# EAGLE design pcb_17 (EAGLE 5.11)
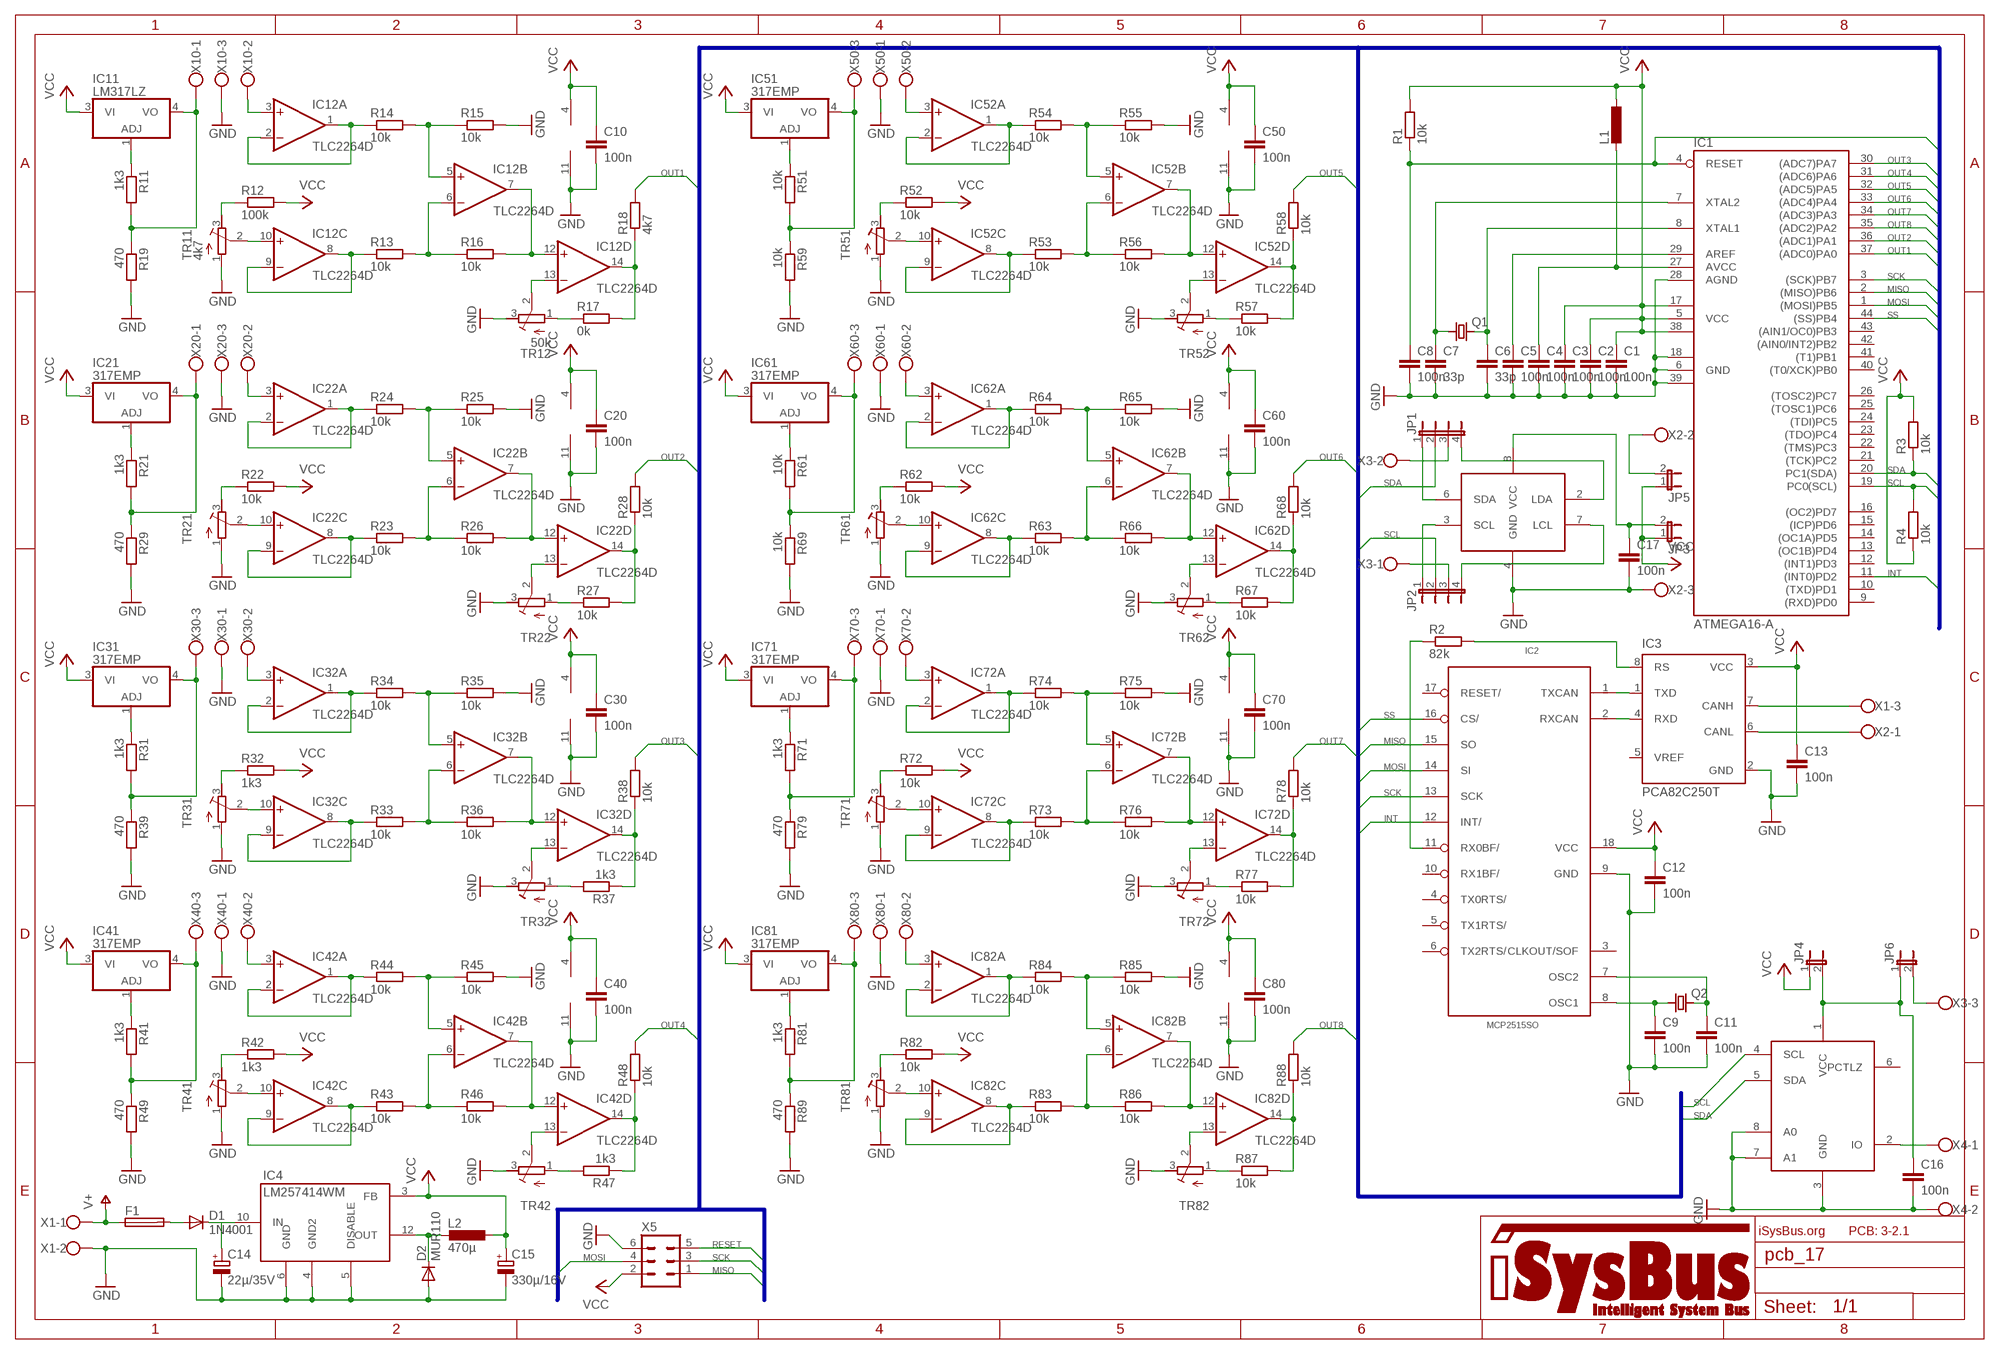
[diagram p0: schematic, sheet 1]

## Parts
C1  100n  CC0805K  [C0805K]
C2  100n  CC0805K  [C0805K]
C3  100n  CC0805K  [C0805K]
C4  100n  CC0805K  [C0805K]
C5  100n  CC0805K  [C0805K]
C6  33p  CC0805K  [C0805K]
C7  33p  CC0805K  [C0805K]
C8  100n  CC0805K  [C0805K]
C9  100n  CC0805K  [C0805K]
C10  100n  CC0805K  [C0805K]
C11  100n  CC0805K  [C0805K]
C12  100n  CC0805K  [C0805K]
C13  100n  CC0805K  [C0805K]
C14  22µ/35V  CPOL153CLV-0605  [153CLV-0605]
C15  330µ/16V  CPOL153CLV-0810  [153CLV-0810]
C16  100n  CC0805K  [C0805K]
C17  100n  CC0805K  [C0805K]
C20  100n  CC0805K  [C0805K]
C30  100n  CC0805K  [C0805K]
C40  100n  CC0805K  [C0805K]
C50  100n  CC0805K  [C0805K]
C60  100n  CC0805K  [C0805K]
C70  100n  CC0805K  [C0805K]
C80  100n  CC0805K  [C0805K]
D1  1N4001  [DO41-10]
D2  MUR110  [DO41-10]
F1  19560  [19560]
IC1  ATMEGA16-A  [TQFP44]
IC2  MCP2515SO  [SO18L]
IC3  PCA82C250T  [SO08]
IC4  LM257414WM  [14WM]
IC5  P82B715TD  [SO08]
IC6  DS2482-100SO  [SO08]
IC11  LM317LZ  317EMP  [SOT223]
IC12  TLC2264D  [SO14]
IC21  317EMP  [SOT223]
IC22  TLC2264D  [SO14]
IC31  317EMP  [SOT223]
IC32  TLC2264D  [SO14]
IC41  317EMP  [SOT223]
IC42  TLC2264D  [SO14]
IC51  317EMP  [SOT223]
IC52  TLC2264D  [SO14]
IC61  317EMP  [SOT223]
IC62  TLC2264D  [SO14]
IC71  317EMP  [SOT223]
IC72  TLC2264D  [SO14]
IC81  317EMP  [SOT223]
IC82  TLC2264D  [SO14]
JP1  JP4E  [JP4]
JP2  JP4E  [JP4]
JP3  JP1E  [JP1]
JP4  JP1E  [JP1]
JP5  JP1E  [JP1]
JP6  JP1E  [JP1]
L1  L-L0805  [L0805]
L2  470µ  L-0207/12  [0207/12]
Q1  Q  [HC49U-V]
Q2  Q  [HC49U-V]
R1  10k  R-EU_M0805  [M0805]
R2  82k  R-EU_M0805  [M0805]
R3  10k  R-EU_M0805  [M0805]
R4  10k  R-EU_M0805  [M0805]
R11  1k3  R-EU_M0805  [M0805]
R12  100k  R-EU_M0805  [M0805]
R13  10k  R-EU_M0805  [M0805]
R14  10k  R-EU_M0805  [M0805]
R15  10k  R-EU_M0805  [M0805]
R16  10k  R-EU_M0805  [M0805]
R17  0k  R-EU_M0805  [M0805]
R18  4k7  R-EU_M0805  [M0805]
R19  470  R-EU_M0805  [M0805]
R21  1k3  R-EU_M0805  [M0805]
R22  10k  R-EU_M0805  [M0805]
R23  10k  R-EU_M0805  [M0805]
R24  10k  R-EU_M0805  [M0805]
R25  10k  R-EU_M0805  [M0805]
R26  10k  R-EU_M0805  [M0805]
R27  10k  R-EU_M0805  [M0805]
R28  10k  R-EU_M0805  [M0805]
R29  470  R-EU_M0805  [M0805]
R31  1k3  R-EU_M0805  [M0805]
R32  1k3  R-EU_M0805  [M0805]
R33  10k  R-EU_M0805  [M0805]
R34  10k  R-EU_M0805  [M0805]
R35  10k  R-EU_M0805  [M0805]
R36  10k  R-EU_M0805  [M0805]
R37  1k3  R-EU_M0805  [M0805]
R38  10k  R-EU_M0805  [M0805]
R39  470  R-EU_M0805  [M0805]
R41  1k3  R-EU_M0805  [M0805]
R42  1k3  R-EU_M0805  [M0805]
R43  10k  R-EU_M0805  [M0805]
R44  10k  R-EU_M0805  [M0805]
R45  10k  R-EU_M0805  [M0805]
R46  10k  R-EU_M0805  [M0805]
R47  1k3  R-EU_M0805  [M0805]
R48  10k  R-EU_M0805  [M0805]
R49  470  R-EU_M0805  [M0805]
R51  10k  R-EU_M0805  [M0805]
R52  10k  R-EU_M0805  [M0805]
R53  10k  R-EU_M0805  [M0805]
R54  10k  R-EU_M0805  [M0805]
R55  10k  R-EU_M0805  [M0805]
R56  10k  R-EU_M0805  [M0805]
R57  10k  R-EU_M0805  [M0805]
R58  10k  R-EU_M0805  [M0805]
R59  10k  R-EU_M0805  [M0805]
R61  10k  R-EU_M0805  [M0805]
R62  10k  R-EU_M0805  [M0805]
R63  10k  R-EU_M0805  [M0805]
R64  10k  R-EU_M0805  [M0805]
R65  10k  R-EU_M0805  [M0805]
R66  10k  R-EU_M0805  [M0805]
R67  10k  R-EU_M0805  [M0805]
R68  10k  R-EU_M0805  [M0805]
R69  10k  R-EU_M0805  [M0805]
R71  1k3  R-EU_M0805  [M0805]
R72  10k  R-EU_M0805  [M0805]
R73  10k  R-EU_M0805  [M0805]
R74  10k  R-EU_M0805  [M0805]
R75  10k  R-EU_M0805  [M0805]
R76  10k  R-EU_M0805  [M0805]
R77  10k  R-EU_M0805  [M0805]
R78  10k  R-EU_M0805  [M0805]
R79  470  R-EU_M0805  [M0805]
R81  1k3  R-EU_M0805  [M0805]
R82  10k  R-EU_M0805  [M0805]
R83  10k  R-EU_M0805  [M0805]
R84  10k  R-EU_M0805  [M0805]
R85  10k  R-EU_M0805  [M0805]
R86  10k  R-EU_M0805  [M0805]
R87  10k  R-EU_M0805  [M0805]
R88  10k  R-EU_M0805  [M0805]
R89  470  R-EU_M0805  [M0805]
TR11  4k7  R-TRIMM64Y  [RTRIM64Y]
TR12  50k  R-TRIMM64Y  [RTRIM64Y]
TR21  R-TRIMM64Y  [RTRIM64Y]
TR22  R-TRIMM64Y  [RTRIM64Y]
TR31  R-TRIMM64Y  [RTRIM64Y]
TR32  R-TRIMM64Y  [RTRIM64Y]
TR41  R-TRIMM64Y  [RTRIM64Y]
TR42  R-TRIMM64Y  [RTRIM64Y]
TR51  R-TRIMM64Y  [RTRIM64Y]
TR52  R-TRIMM64Y  [RTRIM64Y]
TR61  R-TRIMM64Y  [RTRIM64Y]
TR62  R-TRIMM64Y  [RTRIM64Y]
TR71  R-TRIMM64Y  [RTRIM64Y]
TR72  R-TRIMM64Y  [RTRIM64Y]
TR81  R-TRIMM64Y  [RTRIM64Y]
TR82  R-TRIMM64Y  [RTRIM64Y]
U$1  ISYSBUS_LOGO  [ISYSBUS_LOGO]
U$2  FIELD_ISB_PLACE  [FIELD_ISB_PLACE]
U$4  3-2.1  FIELD_PCB_PLACE  [FIELD_PCB_PLACE]
X1  AKL-03_073-03  [AKL-03]
X2  AKL-03_073-03  [AKL-03]
X3  AKL-03_073-03  [AKL-03]
X4  AKL-02_073-02  [AKL-02]
X5  ML6  [ML6]
X10  AKL-03_073-03  [AKL-03]
X20  AKL-03_073-03  [AKL-03]
X30  AKL-03_073-03  [AKL-03]
X40  AKL-03_073-03  [AKL-03]
X50  AKL-03_073-03  [AKL-03]
X60  AKL-03_073-03  [AKL-03]
X70  AKL-03_073-03  [AKL-03]
X80  AKL-03_073-03  [AKL-03]

## Nets
GND: C1.2 C2.2 C3.2 C4.2 C5.2 C6.2 C7.2 C8.2 C9.2 C10.2 C11.2 C12.2 C13.2 C14.- C15.- C16.2 C17.2 C20.2 C30.2 C40.2 C50.2 C60.2 C70.2 C80.2 D2.A IC1.6(GND) IC1.18(GND1) IC1.28(AGND) IC1.39(GND2) IC2.9(GND) IC3.2(GND) IC4.4(GND2) IC4.5(DISABLE) IC4.6(GND) IC5.4(GND) IC6.3(GND) IC6.7(A1) IC6.8(A0) IC12.11(P:V-) IC22.11(P:V-) IC32.11(P:V-) IC42.11(P:V-) IC52.11(P:V-) IC62.11(P:V-) IC72.11(P:V-) IC82.11(P:V-) R15.2 R19.2 R25.2 R29.2 R35.2 R39.2 R45.2 R49.2 R55.2 R59.2 R65.2 R69.2 R75.2 R79.2 R85.2 R89.2 TR11.1(E) TR12.3(A) TR21.1(E) TR22.3(A) TR31.1(E) TR32.3(A) TR41.1(E) TR42.3(A) TR51.1(E) TR52.3(A) TR61.1(E) TR62.3(A) TR71.1(E) TR72.3(A) TR81.1(E) TR82.3(A) X1.2 X2.3 X4.2 X5.6 X10.3 X20.3 X30.1 X40.1 X50.1 X60.1 X70.1 X80.1
INT: IC1.11((INT0)PD2) IC2.12(INT/)
MISO: IC1.2((MISO)PB6) IC2.15(SO) X5.1
MOSI: IC1.1((MOSI)PB5) IC2.14(SI) X5.4
N$1: IC31.1(ADJ) R31.1
N$2: IC31.4(VO) R31.2 R39.1 X30.3
N$3: IC32.1(A:OUT) IC32.2(A:-IN) R34.1
N$4: IC32.8(C:OUT) IC32.9(C:-IN) R33.1
N$5: IC32.5(B:+IN) R34.2 R35.1
N$6: IC32.6(B:-IN) R33.2 R36.1
N$7: IC32.7(B:OUT) IC32.12(D:+IN) R36.2
N$8: IC32.10(C:+IN) TR31.2(S)
N$9: IC41.4(VO) R41.2 R49.1 X40.3
N$10: R32.1 TR31.3(A)
N$11: IC32.14(D:OUT) R37.1 R38.1
N$12: IC41.1(ADJ) R41.1
N$13: IC32.13(D:-IN) TR32.2(S)
N$14: R37.2 TR32.1(E)
N$15: IC32.3(A:+IN) X30.2
N$16: IC52.10(C:+IN) TR51.2(S)
N$17: IC42.3(A:+IN) X40.2
N$18: IC42.1(A:OUT) IC42.2(A:-IN) R44.1
N$19: IC42.8(C:OUT) IC42.9(C:-IN) R43.1
N$20: R42.1 TR41.3(A)
N$21: IC42.10(C:+IN) TR41.2(S)
N$22: IC42.6(B:-IN) R43.2 R46.1
N$23: IC42.7(B:OUT) IC42.12(D:+IN) R46.2
N$24: IC52.13(D:-IN) TR52.2(S)
N$25: IC42.5(B:+IN) R44.2 R45.1
N$26: R47.2 TR42.1(E)
N$27: IC42.14(D:OUT) R47.1 R48.1
N$28: IC42.13(D:-IN) TR42.2(S)
N$29: IC62.10(C:+IN) TR61.2(S)
N$30: IC62.13(D:-IN) TR62.2(S)
N$31: IC22.13(D:-IN) TR22.2(S)
N$32: IC22.10(C:+IN) TR21.2(S)
N$33: IC12.10(C:+IN) TR11.2(S)
N$34: IC12.13(D:-IN) TR12.2(S)
N$35: IC82.10(C:+IN) TR81.2(S)
N$36: IC82.13(D:-IN) TR82.2(S)
N$37: IC72.10(C:+IN) TR71.2(S)
N$38: IC72.13(D:-IN) TR72.2(S)
N$39: IC5.6(SDA) JP1.1
N$40: IC12.3(A:+IN) X10.2
N$41: IC72.3(A:+IN) X70.2
N$42: IC72.1(A:OUT) IC72.2(A:-IN) R74.1
N$43: IC72.8(C:OUT) IC72.9(C:-IN) R73.1
N$44: IC22.3(A:+IN) X20.2
N$45: IC82.3(A:+IN) X80.2
N$46: IC82.1(A:OUT) IC82.2(A:-IN) R84.1
N$47: IC82.8(C:OUT) IC82.9(C:-IN) R83.1
N$48: IC12.1(A:OUT) IC12.2(A:-IN) R14.1
N$49: IC12.8(C:OUT) IC12.9(C:-IN) R13.1
N$50: IC22.1(A:OUT) IC22.2(A:-IN) R24.1
N$51: IC22.8(C:OUT) IC22.9(C:-IN) R23.1
N$52: IC62.8(C:OUT) IC62.9(C:-IN) R63.1
N$53: IC62.1(A:OUT) IC62.2(A:-IN) R64.1
N$54: IC62.3(A:+IN) X60.2
N$55: R62.1 TR61.3(A)
N$56: IC51.4(VO) R51.2 R59.1 X50.3
N$57: IC52.3(A:+IN) X50.2
N$58: IC52.1(A:OUT) IC52.2(A:-IN) R54.1
N$59: IC52.8(C:OUT) IC52.9(C:-IN) R53.1
N$60: IC71.4(VO) R71.2 R79.1 X70.3
N$61: IC51.1(ADJ) R51.1
N$62: R52.1 TR51.3(A)
N$63: IC52.5(B:+IN) R54.2 R55.1
N$64: IC52.6(B:-IN) R53.2 R56.1
N$65: IC71.1(ADJ) R71.1
N$66: IC52.7(B:OUT) IC52.12(D:+IN) R56.2
N$67: IC81.1(ADJ) R81.1
N$68: R57.1 TR52.1(E)
N$69: IC52.14(D:OUT) R57.2 R58.1
N$70: IC11.1(ADJ) R11.1
N$71: IC21.1(ADJ) R21.1
N$72: IC81.4(VO) R81.2 R89.1 X80.3
N$73: IC11.4(VO) R11.2 R19.1 X10.1
N$74: IC21.4(VO) R21.2 R29.1 X20.1
N$75: IC82.6(B:-IN) R83.2 R86.1
N$76: IC82.7(B:OUT) IC82.12(D:+IN) R86.2
N$77: R87.1 TR82.1(E)
N$78: IC82.14(D:OUT) R87.2 R88.1
N$79: R82.1 TR81.3(A)
N$80: R72.1 TR71.3(A)
N$81: IC82.5(B:+IN) R84.2 R85.1
N$82: R77.1 TR72.1(E)
N$83: IC72.14(D:OUT) R77.2 R78.1
N$84: IC61.1(ADJ) R61.1
N$85: IC72.5(B:+IN) R74.2 R75.1
N$86: IC72.6(B:-IN) R73.2 R76.1
N$87: IC72.7(B:OUT) IC72.12(D:+IN) R76.2
N$88: IC61.4(VO) R61.2 R69.1 X60.3
N$89: IC62.6(B:-IN) R63.2 R66.1
N$90: IC62.7(B:OUT) IC62.12(D:+IN) R66.2
N$91: R67.1 TR62.1(E)
N$92: IC62.14(D:OUT) R67.2 R68.1
N$93: R12.1 TR11.3(A)
N$94: IC62.5(B:+IN) R64.2 R65.1
N$95: R22.1 TR21.3(A)
N$96: IC12.5(B:+IN) R14.2 R15.1
N$97: IC12.6(B:-IN) R13.2 R16.1
N$98: IC12.7(B:OUT) IC12.12(D:+IN) R16.2
N$99: IC22.5(B:+IN) R24.2 R25.1
N$100: IC22.6(B:-IN) R23.2 R26.1
N$101: IC22.7(B:OUT) IC22.12(D:+IN) R26.2
N$102: IC3.7(CANH) X1.3
N$103: R17.1 TR12.1(E)
N$104: IC12.14(D:OUT) R17.2 R18.1
N$105: C5.1 IC1.29(AREF)
N$106: IC22.14(D:OUT) R27.2 R28.1
N$107: C4.1 IC1.27(AVCC) L1.2
N$108: R27.1 TR22.1(E)
N$109: IC3.6(CANL) X2.1
N$110: D2.C IC4.12(OUT) L2.2
N$111: IC2.11(RX0BF/) R2.1
N$112: IC5.3(SCL) JP2.1
N$113: C6.1 IC1.8(XTAL1) Q1.2
N$114: C7.1 IC1.7(XTAL2) Q1.1
N$115: IC5.7(LCL) JP2.4
N$116: C14.+ D1.C IC4.10(IN)
N$117: IC6.2(IO) X4.1
N$118: D1.A F1.2
N$119: IC2.1(TXCAN) IC3.1(TXD)
N$120: IC2.2(RXCAN) IC3.4(RXD)
N$121: IC3.8(RS) R2.2
N$122: C9.1 IC2.8(OSC1) Q2.1
N$123: C11.1 IC2.7(OSC2) Q2.2
N$124: IC5.2(LDA) JP1.4
N$125: C17.1 IC5.8(VCC) JP3.2
N$126: JP1.3 X3.2
N$127: C16.1 IC6.1(VCC) JP4.2 JP6.1
N$128: JP5.2 X2.2
N$129: JP6.2 X3.3
OUT1: IC1.37((ADC0)PA0) R18.2
OUT2: IC1.36((ADC1)PA1) R28.2
OUT3: IC1.30((ADC7)PA7) R38.2
OUT4: IC1.31((ADC6)PA6) R48.2
OUT5: IC1.32((ADC5)PA5) R58.2
OUT6: IC1.33((ADC4)PA4) R68.2
OUT7: IC1.34((ADC3)PA3) R78.2
OUT8: IC1.35((ADC2)PA2) R88.2
RESET: C8.1 IC1.4(RESET) R1.1 X5.5
SCK: IC1.3((SCK)PB7) IC2.13(SCK) X5.3
SCL: IC1.19(PC0(SCL)) IC6.4(SCL) JP2.2 R4.2
SCL': JP2.3 X3.1
SDA: IC1.20(PC1(SDA)) IC6.5(SDA) JP1.2 R3.1
SS: IC1.44((SS)PB4) IC2.16(CS/)
V+: F1.1 X1.1
VCC: C1.1 C2.1 C3.1 C10.1 C12.1 C13.1 C15.+ C20.1 C30.1 C40.1 C50.1 C60.1 C70.1 C80.1 IC1.5(VCC) IC1.17(VCC1) IC1.38(VCC2) IC2.18(VCC) IC3.3(VCC) IC4.3(FB) IC11.3(VI) IC12.4(P:V+) IC21.3(VI) IC22.4(P:V+) IC31.3(VI) IC32.4(P:V+) IC41.3(VI) IC42.4(P:V+) IC51.3(VI) IC52.4(P:V+) IC61.3(VI) IC62.4(P:V+) IC71.3(VI) IC72.4(P:V+) IC81.3(VI) IC82.4(P:V+) JP3.1 JP4.1 JP5.1 L1.1 L2.1 R1.2 R3.2 R4.1 R12.2 R22.2 R32.2 R42.2 R52.2 R62.2 R72.2 R82.2 X5.2
Unconnected: IC1.9((RXD)PD0) IC1.10((TXD)PD1) IC1.12((INT1)PD3) IC1.13((OC1B)PD4) IC1.14((OC1A)PD5) IC1.15((ICP)PD6) IC1.16((OC2)PD7) IC1.21((TCK)PC2) IC1.22((TMS)PC3) IC1.23((TDO)PC4) IC1.24((TDI)PC5) IC1.25((TOSC1)PC6) IC1.26((TOSC2)PC7) IC1.40((T0/XCK)PB0) IC1.41((T1)PB1) IC1.42((AIN0/INT2)PB2) IC1.43((AIN1/OC0)PB3) IC2.3(CLKOUT/SOF) IC2.4(TX0RTS/) IC2.5(TX1RTS/) IC2.6(TX2RTS/) IC2.10(RX1BF/) IC2.17(RESET/) IC3.5(VREF) IC6.6(PCTLZ)

## Buses
RESET,SS,SCK,MISO,MOSI,INT,SCL,SDA,RXD,TXD,1W,OUT[1..8]

## Library data of the parts
C1-C13 C16 C17 C20 C30 C40 C50 C60 C70 C80 = isb_capacitors:C: CAPACITOR, European symbol
C14 C15 = isb_capacitors:CPOL: POLARIZED CAPACITOR, European symbol
D1 = isb_diodes:1N4001
D2 = isb_diodes:MUR110
F1 = isb_supply:19560: FUSE HOLDER TR5, Wickmann
IC1 = isb_microcontrollers:ATMEGA16
IC2 = isb_interfacecontrollers:MCP2515
IC3 = isb_interfacecontrollers:PCA82C250
IC4 = isb_supply:LM2574
IC5 = isb_interfacecontrollers:P82B715
IC6 = isb_interfacecontrollers:DS2482-100
IC11 IC21 IC31 IC41 IC51 IC61 IC71 IC81 = linear:*317: Positive VOLTAGE REGULATOR
IC12 IC22 IC32 IC42 IC52 IC62 IC72 IC82 = tcl2264:TLC2264: OP AMP
JP1 JP2 = jumper:JP4E: JUMPER
JP3-JP6 = jumper:JP1E: JUMPER
L1 L2 = isb_inductors:L: INDUCTOR, European symbol
Q1 Q2 = isb_oscillators:Q
R1-R4 R11-R19 R21-R29 R31-R39 R41-R49 R51-R59 R61-R69 R71-R79 R81-R89 = rcl:R-EU_: RESISTOR, European symbol
TR11 TR12 TR21 TR22 TR31 TR32 TR41 TR42 TR51 TR52 TR61 TR62 TR71 TR72 TR81 TR82 = rcl:R-TRIMM: Trimm resistor
U$1 = hausbus:ISYSBUS_LOGO
U$2 = isb_misc:FIELD_ISB
U$4 = isb_misc:FIELD_PCB
X1-X3 X10 X20 X30 X40 X50 X60 X70 X80 = isb_connectors:AKL-03_: WAGO SREW CLAMP
X4 = isb_connectors:AKL-02_: WAGO SREW CLAMP
X5 = isb_connectors:ML6: HARTING

## Board
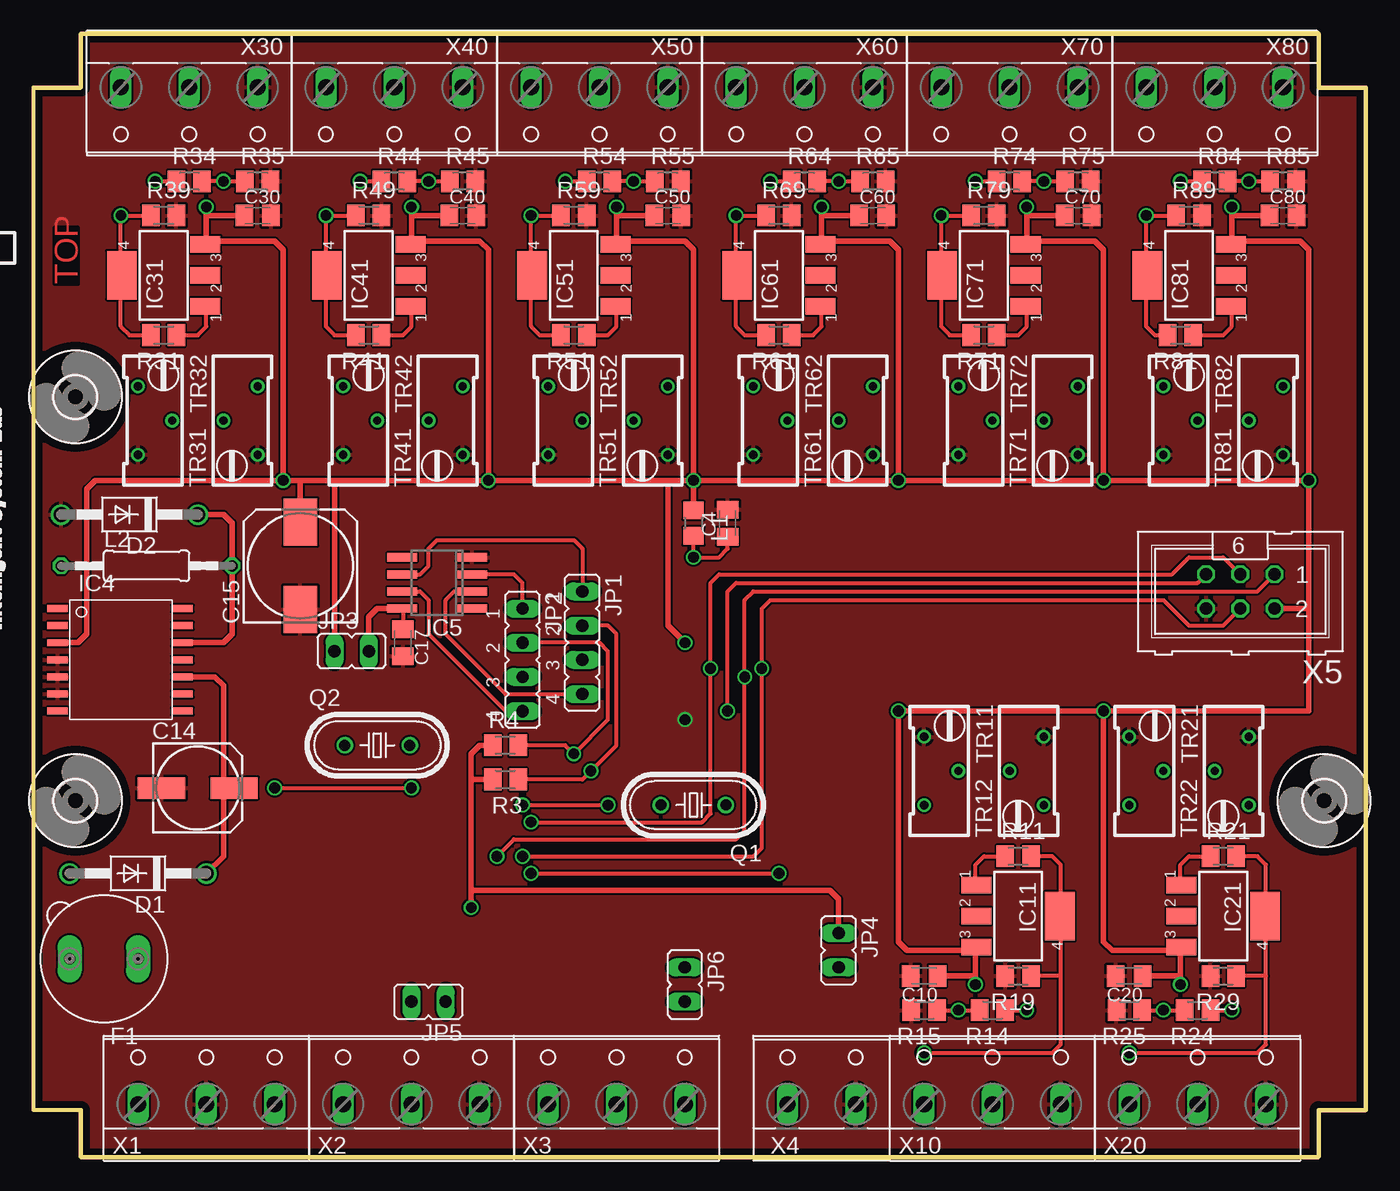
[diagram p1: board, top side]
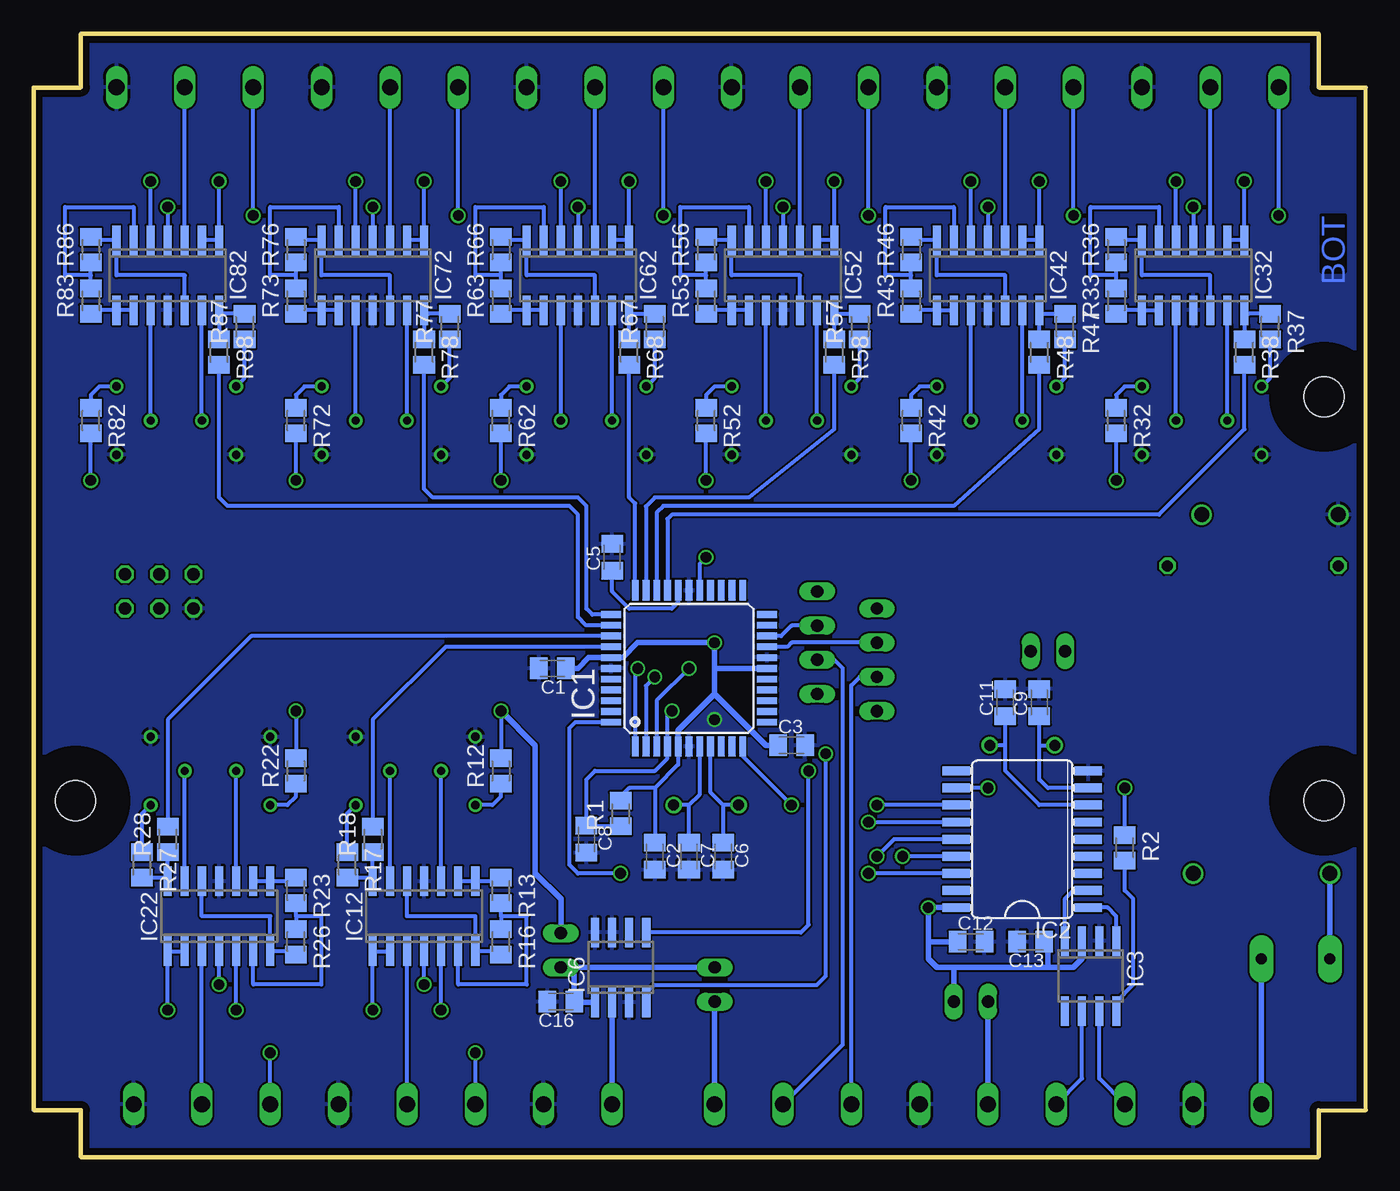
[diagram p2: board, bottom side, seen from below]

Size 99 x 83.5 mm. Coordinates in mm from the lower left corner, seen from the top.
Outline: 3.5,3.5 3.5,0 95.5,0 95.5,3.5 99,3.5 99,79.5 95.5,79.5 95.5,83.5 3.5,83.5 3.5,79.5 0,79.5 0,3.5 3.5,3.5
Copper layers (1*16): Top 0.035mm / dielectric 1.5mm / Bottom 0.035mm
Design rules "PCB-POOL": minimum track width 6mil, minimum drill 12mil, track to track 6mil, track to pad 6mil, pad to pad 6mil, via to via 6mil, smd to smd 6mil, copper to edge 20mil, drill to drill 8mil, minimum pad ring 8mil, minimum via ring 6mil, stop-mask expansion 3mil, vias tented up to drill 0mil, thermal gap 8mil
tKeepout: area 0,79.5 to 3.5,83.5; area 0,0 to 3.5,3.5
bKeepout: area 0,79.5 to 3.5,83.5; area 0,0 to 3.5,3.5
tRestrict: area 95.5,0 to 99,3.5
bRestrict: area 95.5,0 to 99,3.5
Milling: 12 lines

### Footprints (pad centres in the part's own frame; a part is rotated, then mirrored left to right if it is on the bottom)
C0805K = smd 1.3 x 1.6: 1 -1,0; 2 1,0
153CLV-0605 = smd 3.5 x 1.6: + 2.7,0; - -2.7,0
153CLV-0810 = smd 3.5 x 2.5: + 3.25,0; - -3.25,0
DO41-10 = drill 1.118 round: A 5.08,0; C -5.08,0
19560 = drill 0.813 pad 1.778 long: 1 -2.54,0; 2 2.54,0
TQFP44 = smd 1.5 x 0.5: 1 -5.8,4; 2 -5.8,3.2; 3 -5.8,2.4; 4 -5.8,1.6; 5 -5.8,0.8; 6 -5.8,0; 7 -5.8,-0.8; 8 -5.8,-1.6; 9 -5.8,-2.4; 10 -5.8,-3.2; 11 -5.8,-4; 23 5.8,-4; 24 5.8,-3.2; 25 5.8,-2.4; 26 5.8,-1.6; 27 5.8,-0.8; 28 5.8,0; 29 5.8,0.8; 30 5.8,1.6; 31 5.8,2.4; 32 5.8,3.2; 33 5.8,4 | smd 0.5 x 1.5: 12 -4,-5.8; 13 -3.2,-5.8; 14 -2.4,-5.8; 15 -1.6,-5.8; 16 -0.8,-5.8; 17 0,-5.8; 18 0.8,-5.8; 19 1.6,-5.8; 20 2.4,-5.8; 21 3.2,-5.8; 22 4,-5.8; 34 4,5.8; 35 3.2,5.8; 36 2.4,5.8; 37 1.6,5.8; 38 0.8,5.8; 39 0,5.8; 40 -0.8,5.8; 41 -1.6,5.8; 42 -2.4,5.8; 43 -3.2,5.8; 44 -4,5.8
SO18L = smd 0.66 x 2.032: 1 -5.08,-4.902; 2 -3.81,-4.902; 3 -2.54,-4.902; 4 -1.27,-4.902; 5 0,-4.902; 6 1.27,-4.902; 7 2.54,-4.902; 8 3.81,-4.902; 9 5.08,-4.902; 10 5.08,4.902; 11 3.81,4.902; 12 2.54,4.902; 13 1.27,4.902; 14 0,4.902; 15 -1.27,4.902; 16 -2.54,4.902; 17 -3.81,4.902; 18 -5.08,4.902
SO08 = smd 0.6 x 2.2: 1 -1.905,-2.6; 2 -0.635,-2.6; 3 0.635,-2.6; 4 1.905,-2.6; 5 1.905,2.6; 6 0.635,2.6; 7 -0.635,2.6; 8 -1.905,2.6
14WM = smd 0.508 x 1.524: 1 -3.175,-4.699; 2 -1.905,-4.699; 3 -0.635,-4.699; 4 0.635,-4.699; 5 1.905,-4.699; 6 3.175,-4.699; 7 4.445,-4.699; 8 4.445,4.572; 9 3.175,4.572; 10 1.905,4.572; 11 0.635,4.572; 12 -0.635,4.572; 13 -1.905,4.572; 14 -3.175,4.572
SOT223 = smd 1.219 x 2.235: 1 -2.311,-3.099; 2 0,-3.099; 3 2.311,-3.099 | smd 3.6 x 2.2: 4 0,3.099
SO14 = smd 0.6 x 2.2: 1 -3.81,-2.6; 2 -2.54,-2.6; 3 -1.27,-2.6; 4 0,-2.6; 5 1.27,-2.6; 6 2.54,-2.6; 7 3.81,-2.6; 8 3.81,2.6; 9 2.54,2.6; 10 1.27,2.6; 11 0,2.6; 12 -1.27,2.6; 13 -2.54,2.6; 14 -3.81,2.6
JP4 = drill 0.914 long: 1 -3.81,0; 2 -1.27,0; 3 1.27,0; 4 3.81,0
JP1 = drill 0.914 long: 1 0,-1.27; 2 0,1.27
L0805 = smd 1.3 x 1.5: 1 -0.95,0; 2 0.95,0
0207/12 = drill 0.813 octagon: 1 -6.35,0; 2 6.35,0
HC49U-V = drill 0.813 round: 1 -2.413,0; 2 2.413,0
M0805 = smd 1.3 x 1.6: 1 -0.95,0; 2 0.95,0
RTRIM64Y = drill 0.61 round: 1 0,-2.54; 2 -2.54,0; 3 0,2.54
3,0 = hole 3: 0,0
AKL-03 = drill 1.194 long: 1 -5.08,-0.635; 2 0,-0.635; 3 5.08,-0.635
AKL-02 = drill 1.194 long: 1 -2.54,-0.635; 2 2.54,-0.635
ML6 = drill 0.914 octagon: 1 -2.54,-1.27; 2 -2.54,1.27; 3 0,-1.27; 4 0,1.27; 5 2.54,-1.27; 6 2.54,1.27

### Placement (x,y rotation side)
C1  60.46,36.33 180 bottom
C2  52.84,22.36 270 bottom
C3  42.68,30.61 0 bottom
C4  51.57,47.12 90 top
C5  56.02,44.59 90 bottom
C6  47.76,22.36 270 bottom
C7  50.3,22.36 270 bottom
C8  57.92,23.63 270 bottom
C9  24.27,33.79 90 bottom
C10  66.17,13.47 180 top
C11  26.8,33.79 90 bottom
C12  29.34,16.01 0 bottom
C13  24.9,16.01 180 bottom
C14  12.2,27.44 0 top
C15  19.82,43.95 90 top
C16  59.83,11.56 180 bottom
C17  27.44,38.23 270 top
C20  81.42,13.47 180 top
C30  16.64,69.98 0 top
C40  31.88,69.98 0 top
C50  47.12,69.98 0 top
C60  62.37,69.98 0 top
C70  77.61,69.98 0 top
C80  92.84,69.98 0 top
D1  7.76,21.09 180 top
D2  7.12,47.76 180 top
F1  5.21,14.74 180 top
IC1  50.3,36.33 90 bottom
IC2  25.54,23.63 90 bottom
IC3  20.45,13.47 180 bottom
IC4  6.49,37.6 270 top
IC5  29.98,42.68 90 top
IC6  55.38,14.11 0 bottom
IC11  73.16,17.91 270 top
IC12  69.98,17.91 0 bottom
IC21  88.4,17.91 270 top
IC22  85.22,17.91 0 bottom
IC31  9.66,65.54 90 top
IC32  12.84,65.54 180 bottom
IC41  24.9,65.54 90 top
IC42  28.07,65.54 180 bottom
IC51  40.14,65.54 90 top
IC52  43.31,65.54 180 bottom
IC61  55.38,65.54 90 top
IC62  58.55,65.54 180 bottom
IC71  70.62,65.54 90 top
IC72  73.8,65.54 180 bottom
IC81  85.86,65.54 90 top
IC82  89.03,65.54 180 bottom
JP1  40.77,38.23 270 top
JP2  36.33,36.97 270 top
JP3  23.63,37.6 270 top
JP4  59.83,15.38 180 top
JP5  29.34,11.56 90 top
JP6  48.4,12.84 180 top
L1  49.03,47.12 270 top
L2  8.39,43.95 0 top
Q1  49.03,26.17 180 top
Q2  25.54,30.61 0 top
R1  55.38,25.54 90 bottom
R2  17.91,23 270 bottom
R3  35.06,28.07 180 top
R4  35.06,30.61 0 top
R11  73.16,22.36 0 top
R12  64.27,28.71 90 bottom
R13  64.27,19.82 270 bottom
R14  71.25,10.93 180 top
R15  66.17,10.93 180 top
R16  64.27,16.01 270 bottom
R17  75.7,21.73 270 bottom
R18  73.8,23.63 90 bottom
R19  73.16,13.47 180 top
R21  88.4,22.36 0 top
R22  79.51,28.71 90 bottom
R23  79.51,19.82 270 bottom
R24  86.5,10.93 180 top
R25  81.42,10.93 180 top
R26  79.51,16.01 270 bottom
R27  90.94,21.73 270 bottom
R28  89.03,23.63 90 bottom
R29  88.4,13.47 180 top
R31  9.66,61.09 180 top
R32  18.55,54.74 270 bottom
R33  18.55,63.64 90 bottom
R34  11.56,72.53 0 top
R35  16.64,72.53 0 top
R36  18.55,67.44 90 bottom
R37  7.12,61.73 270 bottom
R38  9.03,59.83 270 bottom
R39  9.66,69.98 0 top
R41  24.9,61.09 180 top
R42  33.79,54.74 270 bottom
R43  33.79,63.64 90 bottom
R44  26.8,72.53 0 top
R45  31.88,72.53 0 top
R46  33.79,67.44 90 bottom
R47  22.36,61.73 270 bottom
R48  24.27,59.83 270 bottom
R49  24.9,69.98 0 top
R51  40.14,61.09 180 top
R52  49.03,54.74 270 bottom
R53  49.03,63.64 90 bottom
R54  42.05,72.53 0 top
R55  47.12,72.53 0 top
R56  49.03,67.44 90 bottom
R57  37.6,61.73 90 bottom
R58  39.51,59.83 270 bottom
R59  40.14,69.98 0 top
R61  55.38,61.09 180 top
R62  64.27,54.74 270 bottom
R63  64.27,63.64 90 bottom
R64  57.28,72.53 0 top
R65  62.37,72.53 0 top
R66  64.27,67.44 90 bottom
R67  52.84,61.73 90 bottom
R68  54.74,59.83 270 bottom
R69  55.38,69.98 0 top
R71  70.62,61.09 180 top
R72  79.51,54.74 270 bottom
R73  79.51,63.64 90 bottom
R74  72.53,72.53 0 top
R75  77.61,72.53 0 top
R76  79.51,67.44 90 bottom
R77  68.08,61.73 90 bottom
R78  69.98,59.83 270 bottom
R79  70.62,69.98 0 top
R81  85.22,61.09 180 top
R82  94.75,54.74 270 bottom
R83  94.75,63.64 90 bottom
R84  87.77,72.53 0 top
R85  92.84,72.53 0 top
R86  94.75,67.44 90 bottom
R87  83.32,61.73 90 bottom
R88  85.22,59.83 270 bottom
R89  85.86,69.98 0 top
TR11  66.17,28.71 180 top
TR12  75.06,28.71 0 top
TR21  81.42,28.71 180 top
TR22  90.31,28.71 0 top
TR31  16.64,54.74 0 top
TR32  7.76,54.74 180 top
TR41  31.88,54.74 0 top
TR42  23,54.74 180 top
TR51  47.12,54.74 0 top
TR52  38.23,54.74 180 top
TR61  62.37,54.74 0 top
TR62  53.48,54.74 180 top
TR71  77.61,54.74 0 top
TR72  68.72,54.74 180 top
TR81  92.84,54.74 0 top
TR82  83.95,54.74 180 top
U$1  -2.09,28.39 90 top
U$2  -11.29,65.54 0 top  (outside the outline)
U$3  [3,0]  3.1,56.5 0 top
U$4  -10.66,61.09 0 top  (outside the outline)
U$5  [3,0]  3.1,26.5 0 top
U$7  [3,0]  95.9,26.5 0 top
X1  12.84,4.58 0 top
X2  28.07,4.58 0 top
X3  43.31,4.58 0 top
X4  58.55,4.58 0 top
X5  89.67,42.05 180 top
X10  71.25,4.58 0 top
X20  86.5,4.58 0 top
X30  11.56,78.88 180 top
X40  26.8,78.88 180 top
X50  42.05,78.88 180 top
X60  57.28,78.88 180 top
X70  72.53,78.88 180 top
X80  87.77,78.88 180 top

### Tracks (layer width: path | path; a pad name or v marks a point on that pad's centre or on a via)
GND  (via drill 0.8)
  other vias: 48.4,32.52
  pour Top: -0.5,-0.5 99.19,-0.5 99.19,83.95 -0.5,83.95
  pour Bottom: -0.5,-0.5 99.19,-0.5 99.19,83.95 -0.5,83.95
INT  (via drill 0.8)
  Top 0.305: v36.33,26.17 v42.68,26.17
  Bottom 0.305: IC2.12 v36.33,26.17 | IC1.11 46.3,29.79 v42.68,26.17
MISO  (via drill 0.8)
  Top 0.305: X5.1 90.94,42.05 53.48,42.05 52.84,41.41 v52.84,35.7 52.84,24.27 52.2,23.63 35.7,23.63 v34.42,22.36
  Bottom 0.305: IC2.15 v34.42,22.36 | IC1.2 53.5,35.03 v52.84,35.7
MOSI  (via drill 0.8)
  Top 0.305: X5.4 88.4,39.51 85.86,39.51 83.95,41.41 54.74,41.41 54.11,40.77 v54.11,36.33 54.11,23 53.48,22.36 v36.33,22.36
  Bottom 0.305: IC1.1 54.3,36.14 v54.11,36.33 | IC2.14 35.06,23.63 v36.33,22.36
N$1
  Top 0.305: R31.1 12.2,61.09 12.84,61.73 12.84,63.15 IC31.1
N$2  (via drill 0.8)
  Top 0.305: R31.2 7.12,61.09 6.49,61.73 6.49,65.46 IC31.4 6.49,65.62 v6.49,69.98 R39.1
  Bottom 0.305: v6.49,69.98 X30.3
N$3  (via drill 0.8)
  Top 0.305: v9.03,72.53 R34.1
  Bottom 0.305: v9.03,72.53 IC32.1 IC32.2
N$4
  Bottom 0.305: IC32.9 IC32.8 18.3,62.94 R33.1
N$5  (via drill 0.8)
  Top 0.305: R34.2 v14.11,72.53 R35.1
  Bottom 0.305: IC32.5 v14.11,72.53
N$6
  Bottom 0.305: IC32.6 15.38,70.62 20.45,70.62 20.45,65.54 18.55,65.54 | 18.55,65.54 R36.1 | R33.2 18.55,65.54
N$7
  Bottom 0.305: IC32.12 11.56,65.54 16.64,65.54 IC32.7 18.3,68.14 R36.2
N$8
  Bottom 0.305: TR31.2 IC32.10
N$9  (via drill 0.8)
  Top 0.305: R49.1 v21.73,69.98 21.73,65.62 IC41.4 21.73,65.46 21.73,61.73 22.36,61.09 R41.2
  Bottom 0.305: v21.73,69.98 X40.3
N$10
  Bottom 0.305: R32.1 18.55,56.65 17.91,57.28 TR31.3
N$11
  Bottom 0.305: 9.03,62.37 R38.1 | 9.03,62.37 IC32.14 | R37.1 8.71,62.68 9.03,62.37
N$12
  Top 0.305: R41.1 27.44,61.09 28.07,61.73 28.07,63.15 IC41.1
N$13
  Bottom 0.305: TR32.2 IC32.13
N$14
  Bottom 0.305: R37.2 7.12,57.92 TR32.1
N$15
  Bottom 0.305: IC32.3 X30.2
N$16
  Bottom 0.305: TR51.2 IC52.10
N$17
  Bottom 0.305: IC42.3 X40.2
N$18  (via drill 0.8)
  Top 0.305: v24.27,72.53 R44.1
  Bottom 0.305: v24.27,72.53 IC42.1 IC42.2
N$19
  Bottom 0.305: R43.1 33.53,62.94 IC42.8 IC42.9
N$20
  Bottom 0.305: R42.1 33.79,56.65 33.16,57.28 TR41.3
N$21
  Bottom 0.305: TR41.2 IC42.10
N$22
  Bottom 0.305: IC42.6 30.61,70.62 35.7,70.62 35.7,65.54 33.79,65.54 | 33.79,65.54 R46.1 | R43.2 33.79,65.54
N$23
  Bottom 0.305: IC42.12 26.8,65.54 31.88,65.54 IC42.7 33.53,68.14 R46.2
N$24
  Bottom 0.305: TR52.2 IC52.13
N$25  (via drill 0.8)
  Top 0.305: R44.2 v29.34,72.53 R45.1
  Bottom 0.305: IC42.5 v29.34,72.53
N$26
  Bottom 0.305: R47.2 22.36,57.92 TR42.1
N$27
  Bottom 0.305: R48.1 24.27,62.37 | 24.27,62.37 IC42.14 | R47.1 23.95,62.68 24.27,62.37
N$28
  Bottom 0.305: TR42.2 IC42.13
N$29
  Bottom 0.305: TR61.2 IC62.10
N$30
  Bottom 0.305: TR62.2 IC62.13
N$31
  Bottom 0.305: IC22.13 TR22.2
N$32
  Bottom 0.305: IC22.10 TR21.2
N$33
  Bottom 0.305: IC12.10 TR11.2
N$34
  Bottom 0.305: IC12.13 TR12.2
N$35
  Bottom 0.305: TR81.2 IC82.10
N$36
  Bottom 0.305: TR82.2 IC82.13
N$37
  Bottom 0.305: TR71.2 IC72.10
N$38
  Bottom 0.305: TR72.2 IC72.13
N$39
  Top 0.305: IC5.6 28.71,43.31 29.34,43.95 29.34,45.22 29.98,45.85 40.14,45.85 40.77,45.22 JP1.1
N$40
  Bottom 0.305: X10.2 IC12.3
N$41
  Bottom 0.305: IC72.3 X70.2
N$42  (via drill 0.8)
  Top 0.305: v69.98,72.53 R74.1
  Bottom 0.305: v69.98,72.53 IC72.1 IC72.2
N$43
  Bottom 0.305: IC72.8 IC72.9 79.25,62.94 R73.1
N$44
  Bottom 0.305: X20.2 IC22.3
N$45
  Bottom 0.305: IC82.3 X80.2
N$46  (via drill 0.8)
  Top 0.305: v85.22,72.53 R84.1
  Bottom 0.305: v85.22,72.53 IC82.1 IC82.2
N$47
  Bottom 0.305: IC82.9 IC82.8 94.75,62.94 R83.1
N$48  (via drill 0.8)
  Top 0.305: R14.1 v73.8,10.93
  Bottom 0.305: v73.8,10.93 IC12.1 IC12.2
N$49
  Bottom 0.305: IC12.9 IC12.8 64.53,20.52 R13.1
N$50  (via drill 0.8)
  Top 0.305: R24.1 v89.03,10.93
  Bottom 0.305: v89.03,10.93 IC22.1 IC22.2
N$51
  Bottom 0.305: IC22.9 IC22.8 79.77,20.52 R23.1
N$52
  Bottom 0.305: IC62.9 IC62.8 64.02,62.94 R63.1
N$53  (via drill 0.8)
  Top 0.305: v54.74,72.53 R64.1
  Bottom 0.305: v54.74,72.53 IC62.1 IC62.2
N$54
  Bottom 0.305: IC62.3 X60.2
N$55
  Bottom 0.305: R62.1 64.27,56.65 63.64,57.28 TR61.3
N$56  (via drill 0.8)
  Top 0.305: R51.2 37.6,61.09 36.97,61.73 36.97,65.46 IC51.4 36.97,65.62 v36.97,69.98 R59.1
  Bottom 0.305: v36.97,69.98 X50.3
N$57
  Bottom 0.305: IC52.3 X50.2
N$58  (via drill 0.8)
  Top 0.305: v39.51,72.53 R54.1
  Bottom 0.305: v39.51,72.53 IC52.1 IC52.2
N$59
  Bottom 0.305: IC52.9 IC52.8 49.03,62.94 R53.1
N$60  (via drill 0.8)
  Top 0.305: R79.1 v67.44,69.98 67.44,65.62 IC71.4 67.44,65.46 67.44,61.73 68.08,61.09 R71.2
  Bottom 0.305: v67.44,69.98 X70.3
N$61
  Top 0.305: R51.1 42.68,61.09 43.31,61.73 43.31,63.15 IC51.1
N$62
  Bottom 0.305: R52.1 49.03,56.65 48.4,57.28 TR51.3
N$63  (via drill 0.8)
  Top 0.305: R54.2 v44.59,72.53 R55.1
  Bottom 0.305: IC52.5 v44.59,72.53
N$64
  Bottom 0.305: R53.2 49.03,65.54 | 49.03,65.54 R56.1 | IC52.6 45.85,70.62 50.94,70.62 50.94,65.54 49.03,65.54
N$65
  Top 0.305: R71.1 73.16,61.09 73.8,61.73 73.8,63.15 IC71.1
N$66
  Bottom 0.305: IC52.12 42.05,65.54 47.12,65.54 IC52.7 49.03,68.14 R56.2
N$67
  Top 0.305: R81.1 88.4,61.09 89.03,61.73 89.03,63.15 IC81.1
N$68
  Bottom 0.305: R57.1 37.6,57.92 TR52.1
N$69
  Bottom 0.305: R58.1 39.51,62.37 | 39.51,62.37 IC52.14 | R57.2 39.19,62.68 39.51,62.37
N$70
  Top 0.305: R11.1 70.62,22.36 69.98,21.73 69.98,20.3 IC11.1
N$71
  Top 0.305: R21.1 85.86,22.36 85.22,21.73 85.22,20.3 IC21.1
N$72  (via drill 0.8)
  Top 0.305: R81.2 83.32,61.09 82.69,61.73 82.69,65.46 IC81.4 82.69,65.62 v82.69,69.98 R89.1
  Bottom 0.305: v82.69,69.98 X80.3
N$73  (via drill 0.8)
  Top 0.305: 76.33,13.47 R19.1 | 76.33,13.47 76.33,17.84 IC11.4 76.33,17.99 76.33,21.73 75.7,22.36 R11.2 | v66.17,7.76 75.7,7.76 76.33,8.39 76.33,13.47
  Bottom 0.305: X10.1 v66.17,7.76
N$74  (via drill 0.8)
  Top 0.305: R21.2 90.94,22.36 91.58,21.73 91.58,17.99 IC21.4 91.58,17.84 91.58,13.47 | 91.58,13.47 R29.1 | v81.42,7.76 90.94,7.76 91.58,8.39 91.58,13.47
  Bottom 0.305: X20.1 v81.42,7.76
N$75
  Bottom 0.305: IC82.6 91.58,70.62 96.66,70.62 96.66,65.54 94.75,65.54 | 94.75,65.54 R86.1 | R83.2 94.75,65.54
N$76
  Bottom 0.305: IC82.12 87.77,65.54 92.84,65.54 IC82.7 94.75,68.14 R86.2
N$77
  Bottom 0.305: R87.1 83.32,57.92 TR82.1
N$78
  Bottom 0.305: 85.22,62.37 R88.1 | 85.22,62.37 IC82.14 | R87.2 84.91,62.68 85.22,62.37
N$79
  Bottom 0.305: R82.1 94.75,56.65 94.11,57.28 TR81.3
N$80
  Bottom 0.305: R72.1 79.51,56.65 78.88,57.28 TR71.3
N$81  (via drill 0.8)
  Top 0.305: R84.2 v90.31,72.53 R85.1
  Bottom 0.305: IC82.5 v90.31,72.53
N$82
  Bottom 0.305: R77.1 68.08,57.92 TR72.1
N$83
  Bottom 0.305: 69.98,62.37 R78.1 | 69.98,62.37 IC72.14 | R77.2 69.67,62.68 69.98,62.37
N$84
  Top 0.305: R61.1 57.92,61.09 58.55,61.73 58.55,63.15 IC61.1
N$85  (via drill 0.8)
  Top 0.305: R74.2 v75.06,72.53 R75.1
  Bottom 0.305: IC72.5 v75.06,72.53
N$86
  Bottom 0.305: R73.2 79.51,65.54 | 79.51,65.54 R76.1 | IC72.6 76.33,70.62 81.42,70.62 81.42,65.54 79.51,65.54
N$87
  Bottom 0.305: IC72.12 72.53,65.54 77.61,65.54 IC72.7 79.25,68.14 R76.2
N$88  (via drill 0.8)
  Top 0.305: R69.1 v52.2,69.98 52.2,65.62 IC61.4 52.2,65.46 52.2,61.73 52.84,61.09 R61.2
  Bottom 0.305: v52.2,69.98 X60.3
N$89
  Bottom 0.305: IC62.6 61.09,70.62 66.17,70.62 66.17,65.54 64.27,65.54 | R63.2 64.27,65.54 | 64.27,65.54 R66.1
N$90
  Bottom 0.305: IC62.12 57.28,65.54 62.37,65.54 IC62.7 64.02,68.14 R66.2
N$91
  Bottom 0.305: R67.1 52.84,57.92 TR62.1
N$92
  Bottom 0.305: R68.1 IC62.14 54.48,62.68 R67.2
N$93
  Bottom 0.305: R12.1 64.27,26.8 64.91,26.17 TR11.3
N$94  (via drill 0.8)
  Top 0.305: R64.2 v59.83,72.53 R65.1
  Bottom 0.305: IC62.5 v59.83,72.53
N$95
  Bottom 0.305: R22.1 79.51,26.8 80.14,26.17 TR21.3
N$96  (via drill 0.8)
  Top 0.305: R14.2 v68.72,10.93 R15.1
  Bottom 0.305: v68.72,10.93 IC12.5
N$97
  Bottom 0.305: IC12.6 67.44,12.84 62.37,12.84 62.37,17.91 64.27,17.91 | 64.27,17.91 R13.2 | 64.27,17.91 R16.1
N$98
  Bottom 0.305: IC12.12 71.25,17.91 66.17,17.91 IC12.7 64.53,15.31 R16.2
N$99  (via drill 0.8)
  Top 0.305: R25.1 v83.95,10.93 R24.2
  Bottom 0.305: v83.95,10.93 IC22.5
N$100
  Bottom 0.305: 79.51,17.91 R26.1 | 79.51,17.91 R23.2 | IC22.6 82.69,12.84 77.61,12.84 77.61,17.91 79.51,17.91
N$101
  Bottom 0.305: IC22.12 86.5,17.91 81.42,17.91 IC22.7 79.77,15.31 R26.2
N$102
  Bottom 0.305: IC3.7 19.82,5.85 X1.3
N$103
  Bottom 0.305: R17.1 75.7,25.54 TR12.1
N$104
  Bottom 0.305: IC12.14 73.8,21.09 | 73.8,21.09 R18.1 | R17.2 74.11,20.77 73.8,21.09
N$105
  Bottom 0.305: IC1.29 51.1,41.24 51.57,40.77 54.74,40.77 56.02,42.05 C5.1
N$106
  Bottom 0.305: IC22.14 89.03,21.09 | 89.03,21.09 R28.1 | R27.2 89.35,20.77 89.03,21.09
N$107  (via drill 0.8)
  Top 0.305: L1.2 v49.03,44.59 50.94,44.59 51.57,45.22 C4.1
  Bottom 0.305: IC1.27 49.5,44.12 v49.03,44.59
N$108
  Bottom 0.305: R27.1 90.94,25.54 TR22.1
N$109
  Bottom 0.305: IC3.6 21.09,5.85 X2.1
N$110
  Top 0.406: IC4.12 14.11,38.23 14.74,38.87 L2.2 14.74,47.12 14.11,47.76 D2.C
N$111  (via drill 0.8)
  Top 0.305: v17.91,27.44 v28.07,27.44
  Bottom 0.305: v28.07,27.44 IC2.11 | R2.1 v17.91,27.44
N$112
  Top 0.305: IC5.3 35.7,43.31 36.33,42.68 JP2.1
N$113
  Bottom 0.305: IC1.8 48.7,27.11 47.76,26.17 | 47.76,26.17 C6.1 | Q1.2 47.76,26.17
N$114
  Bottom 0.305: C7.1 50.3,26.17 | 50.3,26.17 Q1.1 | IC1.7 49.5,26.97 50.3,26.17
N$115
  Top 0.305: IC5.7 28.71,42.05 29.34,41.41 29.34,38.87 35.06,33.16 JP2.4
N$116
  Top 0.406: IC4.10 13.47,35.7 14.11,35.06 14.11,27.6 C14.+ 14.11,27.28 14.11,22.36 D1.C
N$117
  Bottom 0.406: X4.1 IC6.2
N$118
  Bottom 0.406: F1.2 D1.A
N$119
  Bottom 0.305: IC3.1 18.55,17.91 19.18,18.55 IC2.1
N$120
  Bottom 0.305: IC2.2 21.73,19.82 22.36,19.18 IC3.4
N$121
  Bottom 0.305: IC3.8 18.55,11.56 17.28,12.84 17.28,19.18 17.91,19.82 R2.2
N$122
  Bottom 0.305: 24.27,30.61 24.27,28.07 23.63,27.44 IC2.8 | 24.27,30.61 C9.1 | 24.27,30.61 Q2.1
N$123
  Bottom 0.305: IC2.7 24.27,26.17 26.8,28.71 26.8,30.61 | 26.8,30.61 C11.1 | 26.8,30.61 Q2.2
N$124
  Top 0.305: IC5.2 31.25,42.05 30.61,41.41 30.61,38.87 35.06,34.42 JP1.4
N$125
  Top 0.305: C17.1 27.44,40.72 IC5.8
  Top 0.406: JP3.2 24.9,40.14 25.54,40.77 IC5.8
N$126
  Bottom 0.305: X3.2 38.87,8.39 38.87,36.33 39.51,36.97 JP1.3
N$127
  Bottom 0.406: IC6.1 58.77,11.51 C16.1 58.83,13.84 58.55,14.11 | JP6.1 58.55,14.11 | 58.55,14.11 JP4.2
N$128
  Bottom 0.406: X2.2 JP5.2
N$129
  Bottom 0.406: X3.3 JP6.2
OUT1
  Bottom 0.305: IC1.37 68.39,37.93 73.8,32.52 R18.2
OUT2
  Bottom 0.305: IC1.36 82.83,38.73 89.03,32.52 R28.2
OUT3
  Bottom 0.305: R38.2 9.03,54.11 15.38,47.76 51.57,47.76 51.9,47.43 IC1.30
OUT4
  Bottom 0.305: R48.2 24.27,54.11 30.61,48.4 52.2,48.4 52.7,47.9 IC1.31
OUT5
  Bottom 0.305: R58.2 39.51,54.11 45.85,49.03 52.84,49.03 53.5,48.37 IC1.32
OUT6
  Bottom 0.305: R68.2 54.74,49.03 54.3,48.59 IC1.33
OUT7
  Bottom 0.305: R78.2 69.98,49.66 69.35,49.03 58.55,49.03 57.92,48.4 57.92,40.77 57.48,40.33 IC1.34
OUT8
  Bottom 0.305: R88.2 85.22,49.03 84.59,48.4 59.19,48.4 58.55,47.76 58.55,40.14 57.95,39.53 IC1.35
RESET  (via drill 0.8)
  Top 0.305: X5.5 86.5,42.68 52.2,42.68 51.57,42.05 v51.57,33.16
  Bottom 0.305: v51.57,33.16 51.9,32.83 IC1.4 51.9,29.65 52.84,28.71 57.28,28.71 57.92,28.07 C8.1 57.88,24.59 R1.1
SCK  (via drill 0.8)
  Top 0.305: X5.3 88.4,44.59 85.86,44.59 84.59,43.31 50.94,43.31 50.3,42.68 v50.3,36.33 50.3,25.54 49.66,24.9 v36.97,24.9
  Bottom 0.305: IC2.13 v36.97,24.9 | IC1.3 52.7,33.93 v50.3,36.33
SCL  (via drill 0.8)
  Top 0.305: JP2.2 42.05,38.23 42.68,37.6 42.68,32.52 v40.14,29.98 39.51,30.61 R4.2
  Bottom 0.305: IC1.19 42.98,37.93 42.68,38.23 JP2.2 | v40.14,29.98 40.14,13.47 40.84,12.78 52.9,12.78 53.48,12.2 IC6.4
SCL'
  Bottom 0.305: X3.1 38.23,35.06 37.6,35.7 JP2.3
SDA  (via drill 0.8)
  Top 0.305: JP1.2 42.68,39.51 43.31,38.87 43.31,30.61 v41.41,28.71 40.77,28.07 R3.1
  Bottom 0.305: IC1.20 43.45,38.73 42.68,39.51 JP1.2 | IC6.5 41.98,16.7 41.41,17.28 v41.41,28.71
SS  (via drill 0.8)
  Top 0.305: v36.97,21.09 v55.38,21.09
  Bottom 0.305: IC2.16 v36.97,21.09 | IC1.44 58.74,32.33 59.19,31.88 59.19,21.73 58.55,21.09 v55.38,21.09
V+
  Bottom 0.406: X1.1 F1.1
VCC  (via drill 0.8)
  Top 0.305: IC31.3 12.84,67.93 IC32.4 12.89,68.08 | 28.07,67.93 IC41.3 28.23,68.08 | IC51.3 43.31,67.93 IC52.4 43.38,68.08 | IC61.3 58.55,67.93 IC62.4 58.62,68.08 | IC81.3 89.03,67.93 IC82.4 89.09,68.08 | IC11.3 69.98,15.53 IC12.4 69.92,15.38 | IC21.3 85.22,15.53 IC22.4 85.17,15.38 | 73.95,68.08 IC71.3 73.8,67.93
  Top 0.406: IC32.4 12.84,69.98 | 12.84,69.98 v12.84,70.62 | 28.07,67.93 28.07,69.98 | 28.07,69.98 v28.07,70.62 | IC52.4 43.31,69.98 | 43.31,69.98 v43.31,70.62 | IC62.4 58.55,69.98 | 58.55,69.98 v58.55,70.62 | IC82.4 89.03,69.98 | 89.03,69.98 v89.03,70.62 | IC12.4 69.98,13.47 | 69.98,13.47 v69.98,12.84 | IC22.4 85.22,13.47 | 85.22,13.47 v85.22,12.84 | v94.75,50.3 94.75,67.44 94.11,68.08 89.09,68.08 | v79.51,50.3 79.51,67.44 78.88,68.08 73.95,68.08 | v64.27,50.3 64.27,67.44 63.64,68.08 58.62,68.08 | v49.03,50.3 49.03,67.44 48.4,68.08 43.38,68.08 | v33.79,50.3 33.79,67.44 33.16,68.08 28.23,68.08 | v18.55,50.3 18.55,67.44 17.91,68.08 12.89,68.08 | 69.92,15.38 64.91,15.38 64.27,16.01 v64.27,33.16 v79.51,33.16 | v79.51,33.16 79.51,16.01 80.14,15.38 85.17,15.38 | 19.82,50.3 v18.55,50.3 | 22.36,50.3 19.82,50.3 | v33.79,50.3 22.36,50.3 | 47.12,50.3 v33.79,50.3 | v49.03,50.3 47.12,50.3 | v64.27,50.3 v49.03,50.3 | v79.51,50.3 v64.27,50.3 | v94.75,50.3 v79.51,50.3 | 69.98,13.47 C10.1 | 85.22,13.47 C20.1 | 12.84,69.98 C30.1 | 28.07,69.98 C40.1 | 43.31,69.98 C50.1 | 58.55,69.98 C60.1 | 73.8,67.93 73.8,69.98 | 73.8,69.98 v73.8,70.62 | 73.8,69.98 C70.1 | 89.03,69.98 C80.1 | IC4.3 3.31,38.23 3.95,38.87 3.95,43.95 | 3.95,43.95 3.95,49.66 4.58,50.3 v18.55,50.3 | 3.95,43.95 L2.1 | 19.82,50.3 C15.+ | v49.03,50.3 L1.1 | 22.36,50.3 JP3.1 | 94.75,40.77 v94.75,50.3 | 94.75,40.77 94.75,33.16 v79.51,33.16 | 94.75,40.77 X5.2 | 47.12,50.3 47.12,39.51 v48.4,38.23 | JP4.1 59.83,19.18 59.19,19.82 32.52,19.82 | v32.52,18.55 32.52,19.82 | 32.52,19.82 32.52,28.07 | 32.52,28.07 32.52,29.98 33.16,30.61 R4.1 | 32.52,28.07 R3.2
  Bottom 0.305: v12.84,70.62 IC32.4 | v28.07,70.62 IC42.4 | v43.31,70.62 IC52.4 | v58.55,70.62 IC62.4 | v89.03,70.62 IC82.4 | v69.98,12.84 IC12.4 | v85.22,12.84 IC22.4 | v94.75,50.3 R82.2 | v79.51,50.3 R72.2 | v64.27,50.3 R62.2 | v49.03,50.3 R52.2 | v33.79,50.3 R42.2 | v18.55,50.3 R32.2 | v64.27,33.16 R12.2 | v79.51,33.16 R22.2 | v73.8,70.62 IC72.4 | IC1.5 51.1,29.18 52.84,27.44 | 52.84,27.44 C2.1 | R1.2 55.38,26.8 54.74,27.44 52.84,27.44
  Bottom 0.406: C1.1 58.55,36.33 57.76,37.13 IC1.38 55.22,37.13 54.11,38.23 v48.4,38.23 48.4,36.33 | IC3.3 21.09,14.74 21.73,14.11 23.63,14.11 | 23.63,14.11 30.61,14.11 | 30.61,14.11 31.88,14.11 32.52,14.74 32.52,16.01 | IC2.18 v32.52,18.55 32.52,16.01 | 32.52,16.01 C12.1 | C13.1 23.9,15.64 23.63,15.38 23.63,14.11 | 48.4,36.33 IC1.17 | IC1.5 51.1,31.72 48.4,34.42 | C3.1 44.59,30.61 48.4,34.42 | 48.4,36.33 48.4,34.42 | JP4.1 59.83,19.18 61.73,21.09 61.73,30.61 v64.27,33.16 | 30.61,14.11 JP5.1

### Text on the board
Top: TOP
Bottom: BOT
tDocu: IDENTIFY | RESET | PWR | CAN